# Altium schematic sheet InputCircuits.SchDoc
size A4; SheetNumber: 3; SheetTotal: 6
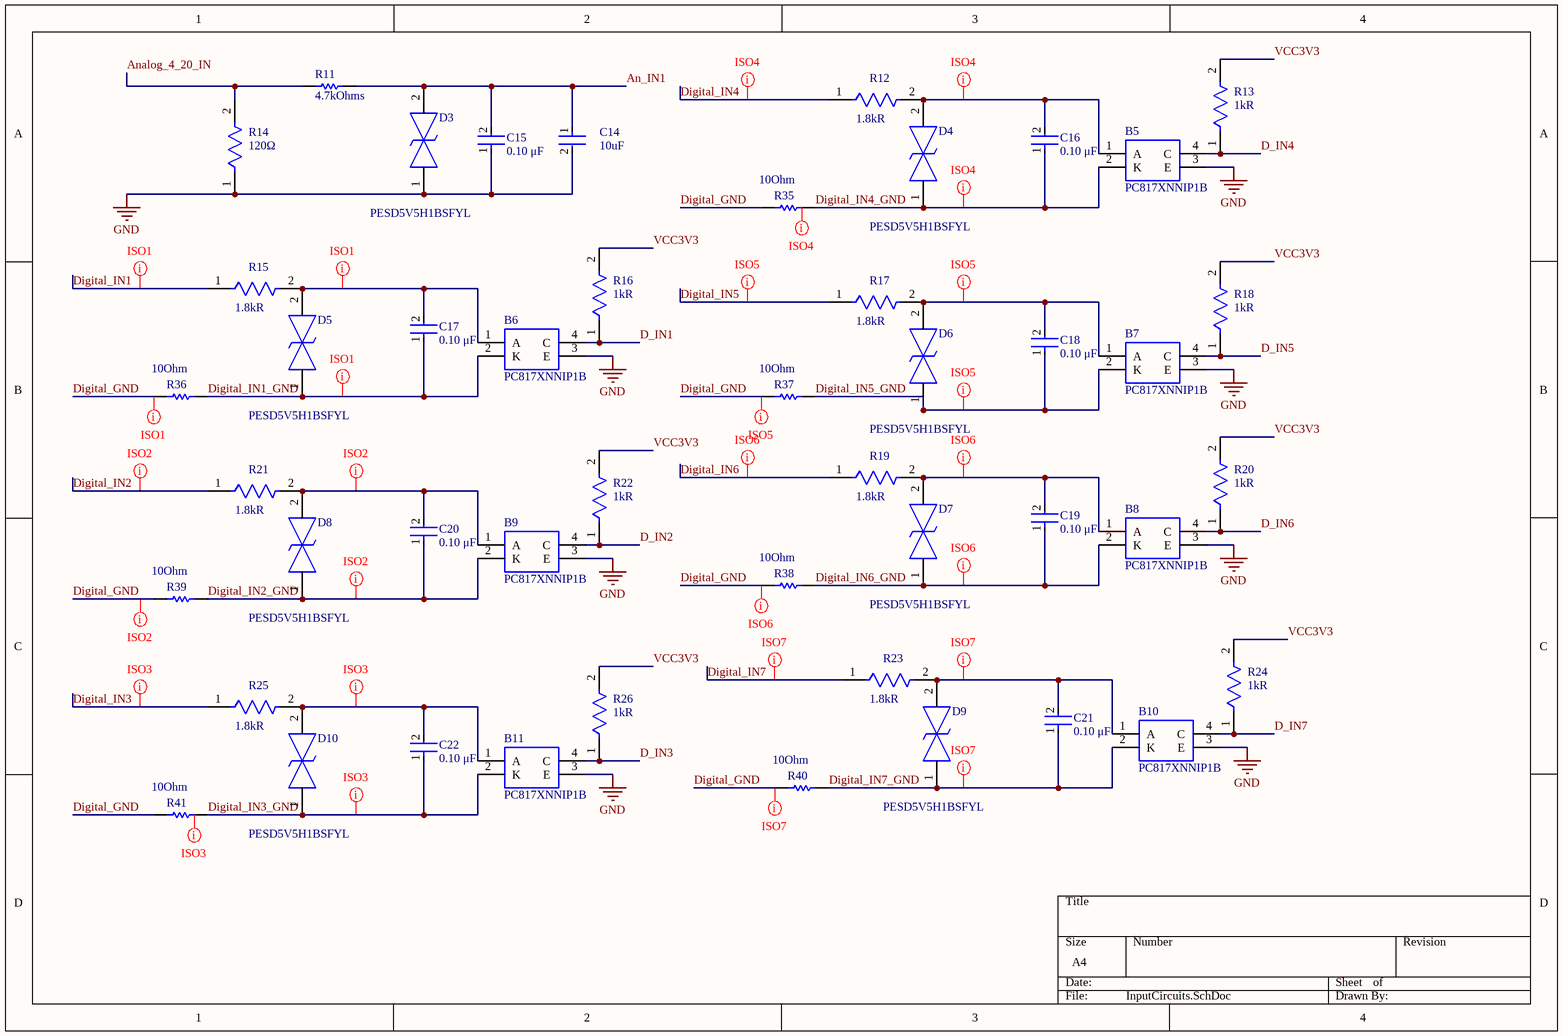
[diagram p0: InputCircuits.SchDoc]

## Parts
B5  PC817XNNIP1B  [SOP254P960X420-4N]
B6  PC817XNNIP1B  [SOP254P960X420-4N]
B7  PC817XNNIP1B  [SOP254P960X420-4N]
B8  PC817XNNIP1B  [SOP254P960X420-4N]
B9  PC817XNNIP1B  [SOP254P960X420-4N]
B10  PC817XNNIP1B  [SOP254P960X420-4N]
B11  PC817XNNIP1B  [SOP254P960X420-4N]
C14  Capacitance: 10uF  [FP-MK212G-MFG]  (hidden comment: LMK212B7106KG-TD)
C15  value 0.10 μF  [FP-C0805C-DN-MFG]  (hidden comment: C0805C104K5RAC7411)
C16  value 0.10 μF  [FP-C0805C-DN-MFG]  (hidden comment: C0805C104K5RAC7411)
C17  value 0.10 μF  [FP-C0805C-DN-MFG]  (hidden comment: C0805C104K5RAC7411)
C18  value 0.10 μF  [FP-C0805C-DN-MFG]  (hidden comment: C0805C104K5RAC7411)
C19  value 0.10 μF  [FP-C0805C-DN-MFG]  (hidden comment: C0805C104K5RAC7411)
C20  value 0.10 μF  [FP-C0805C-DN-MFG]  (hidden comment: C0805C104K5RAC7411)
C21  value 0.10 μF  [FP-C0805C-DN-MFG]  (hidden comment: C0805C104K5RAC7411)
C22  value 0.10 μF  [FP-C0805C-DN-MFG]  (hidden comment: C0805C104K5RAC7411)
D3  PESD5V5H1BSFYL  [PESD5V0H1BSFYL]
D4  PESD5V5H1BSFYL  [PESD5V0H1BSFYL]
D5  PESD5V5H1BSFYL  [PESD5V0H1BSFYL]
D6  PESD5V5H1BSFYL  [PESD5V0H1BSFYL]
D7  PESD5V5H1BSFYL  [PESD5V0H1BSFYL]
D8  PESD5V5H1BSFYL  [PESD5V0H1BSFYL]
D9  PESD5V5H1BSFYL  [PESD5V0H1BSFYL]
D10  PESD5V5H1BSFYL  [PESD5V0H1BSFYL]
R11  Resistance: 4.7kOhms  [RESC1608X55X25LL10T15]  (hidden comment: RC0603FR-074K7L)
R12  Resistance: 1.8kR  [FP-RC0603-0_55-IPC_C]  (hidden comment: RC0603FR-071K8L)
R13  Resistance: 1kR  [FP-RC0603-0_55-IPC_C]  (hidden comment: RC0603FR-071KL)
R14  Resistance: 120Ω  [FP-RT1206-MFG]  (hidden comment: RT1206FRE07120RL)
R15  Resistance: 1.8kR  [FP-RC0603-0_55-IPC_C]  (hidden comment: RC0603FR-071K8L)
R16  Resistance: 1kR  [FP-RC0603-0_55-IPC_C]  (hidden comment: RC0603FR-071KL)
R17  Resistance: 1.8kR  [FP-RC0603-0_55-IPC_C]  (hidden comment: RC0603FR-071K8L)
R18  Resistance: 1kR  [FP-RC0603-0_55-IPC_C]  (hidden comment: RC0603FR-071KL)
R19  Resistance: 1.8kR  [FP-RC0603-0_55-IPC_C]  (hidden comment: RC0603FR-071K8L)
R20  Resistance: 1kR  [FP-RC0603-0_55-IPC_C]  (hidden comment: RC0603FR-071KL)
R21  Resistance: 1.8kR  [FP-RC0603-0_55-IPC_C]  (hidden comment: RC0603FR-071K8L)
R22  Resistance: 1kR  [FP-RC0603-0_55-IPC_C]  (hidden comment: RC0603FR-071KL)
R23  Resistance: 1.8kR  [FP-RC0603-0_55-IPC_C]  (hidden comment: RC0603FR-071K8L)
R24  Resistance: 1kR  [FP-RC0603-0_55-IPC_C]  (hidden comment: RC0603FR-071KL)
R25  Resistance: 1.8kR  [FP-RC0603-0_55-IPC_C]  (hidden comment: RC0603FR-071K8L)
R26  Resistance: 1kR  [FP-RC0603-0_55-IPC_C]  (hidden comment: RC0603FR-071KL)
R35  Resistance: 10Ohm  [RESC2013X60X35ML10T20]  (hidden comment: RC0805FR-0710RL)
R36  Resistance: 10Ohm  [RESC2013X60X35ML10T20]  (hidden comment: RC0805FR-0710RL)
R37  Resistance: 10Ohm  [RESC2013X60X35ML10T20]  (hidden comment: RC0805FR-0710RL)
R38  Resistance: 10Ohm  [RESC2013X60X35ML10T20]  (hidden comment: RC0805FR-0710RL)
R39  Resistance: 10Ohm  [RESC2013X60X35ML10T20]  (hidden comment: RC0805FR-0710RL)
R40  Resistance: 10Ohm  [RESC2013X60X35ML10T20]  (hidden comment: RC0805FR-0710RL)
R41  Resistance: 10Ohm  [RESC2013X60X35ML10T20]  (hidden comment: RC0805FR-0710RL)

## Nets
GND: B5.3(E) B6.3(E) B7.3(E) B8.3(E) B9.3(E) B10.3(E) B11.3(E) C14.2 C15.1 D3.1 R14.1
An_IN1: C14.1 C15.2 D3.2 R11.1
Analog_4_20_IN: R11.2 R14.2
D_IN1: B6.4(C) R16.1
D_IN2: B9.4(C) R22.1
D_IN3: B11.4(C) R26.1
D_IN4: B5.4(C) R13.1
D_IN5: B7.4(C) R18.1
D_IN6: B8.4(C) R20.1
D_IN7: B10.4(C) R24.1
Digital_GND: R35.1 R36.1 R37.1 R38.1 R39.1 R40.1 R41.1
Digital_IN1: R15.1
Digital_IN1_GND: B6.2(K) C17.1 D5.1 R36.2
Digital_IN2: R21.1
Digital_IN2_GND: B9.2(K) C20.1 D8.1 R39.2
Digital_IN3: R25.1
Digital_IN3_GND: B11.2(K) C22.1 D10.1 R41.2
Digital_IN4: R12.1
Digital_IN4_GND: B5.2(K) C16.1 D4.1 R35.2
Digital_IN5: R17.1
Digital_IN5_GND: B7.2(K) C18.1 D6.1 R37.2
Digital_IN6: R19.1
Digital_IN6_GND: B8.2(K) C19.1 D7.1 R38.2
Digital_IN7: R23.1
Digital_IN7_GND: B10.2(K) C21.1 D9.1 R40.2
VCC3V3: R13.2 R16.2 R18.2 R20.2 R22.2 R24.2 R26.2
NetB5_1: B5.1(A) C16.2 D4.2 R12.2
NetB6_1: B6.1(A) C17.2 D5.2 R15.2
NetB7_1: B7.1(A) C18.2 D6.2 R17.2
NetB8_1: B8.1(A) C19.2 D7.2 R19.2
NetB9_1: B9.1(A) C20.2 D8.2 R21.2
NetB10_1: B10.1(A) C21.2 D9.2 R23.2
NetB11_1: B11.1(A) C22.2 D10.2 R25.2

## Layout directives
net class ISO1: Digital_GND, Digital_IN1, Digital_IN1_GND, NetB6_1
net class ISO2: Digital_GND, Digital_IN2, Digital_IN2_GND, NetB9_1
net class ISO3: (no net found under the mark), Digital_IN3, Digital_IN3_GND, NetB11_1
net class ISO4: (no net found under the mark), Digital_IN4, Digital_IN4_GND, NetB5_1
net class ISO5: Digital_GND, Digital_IN5, Digital_IN5_GND, NetB7_1
net class ISO6: Digital_GND, Digital_IN6, Digital_IN6_GND, NetB8_1
net class ISO7: Digital_GND, Digital_IN7, Digital_IN7_GND, NetB10_1

## Library data of the parts
B5-B11 = PC817XNNIP1B: Transistor Output Optocouplers Photocoupler; Manufacturer_Name: Sharp Microelectronics; Geometry.Height: 4.2mm; Mouser Part Number: 852-PC817XNNIP1B; Mouser Price/Stock: https://www.mouser.co.uk/ProductDetail/Sharp-Microelectronics/PC817XNNIP1B?qs=rrS6PyfT74dJvnx7366b6Q%3D%3D; Manufacturer_Part_Number: PC817XNNIP1B; Datasheet Link: *
C14 = CMP-2000-06556-2: CAP CER 10UF 10V X7R 0805; Tolerance: 10%; Number of Pins: 2; Height: 1.25mm; Length: 0.079inch; Case Code (Metric): 2012; Thickness: 0.053inch; Width: 0.049inch; Dielectric: X7R; Case Code (Imperial): 0805; Case/Package: 0805; Termination: SMD/SMT; Resistor Type: Ceramic; Lead Free: Lead Free; Voltage Rating: 10V; Package Quantity: 1; Max Operating Temperature: 125°C; RoHS Compliant: Yes; Series: M; Packaging: Tape and Reel; Mount: Surface Mount; Min Operating Temperature: -55°C; Voltage Rating (DC): 10V
C15-C22 = CMP-2007-00277-3: C0805 0.10 μF X7R 30ppm/°C 10.00% 50 V; Manufacturer: KEMET; Material: Ceramic; Tolerance: 0.1; Voltage Rating: 50 V; Temperature: -55°C to +125°C; Device Class L3: Ceramic Capacitors; Temperature Characteristic: X7R; Device Class L1: Passive Components; Category: Cap; Temperature Coefficient: 30ppm/°C; Manufacturer Part Number: C0805C104K5RAC7411; Temperature Range High: +125°C; Height: 0.88mm; RoHS: TRUE; ComponentLink2Description: Datasheet; Lead Free: Yes; Capacitance: 0.10 μF; Package: C0805C-DN; Temperature Range Low: -55°C; ComponentLink2URL: https://content.kemet.com/datasheets/KEM_C1003_C0G_SMD.pdf; Automotive: No; Ipc Land Pattern Name: CAPC200125X78; Octopart: https://octopart.com/c0805c104k5rac7411-kemet-18508045; Device Class L2: Capacitors
D3-D10 = PESD5V5H1BSFYL: ESD Suppressors / TVS Diodes; Manufacturer_Name: Nexperia; Geometry.Height: 0.325mm; Mouser Part Number: 771-PESD5V5H1BSFYL; Mouser Price/Stock: https://www.mouser.co.uk/ProductDetail/Nexperia/PESD5V5H1BSFYL?qs=T3oQrply3y9CfA%2FMHqAcog%3D%3D; Manufacturer_Part_Number: PESD5V5H1BSFYL; Datasheet Link: https://assets.nexperia.com/documents/data-sheet/PESD5V0H1BSF.pdf
R11 = CMP-2000-06942-1: Chip Resistor, 4.7 KOhm, +/- 1%, 0.1 W, -55 to 155 degC, 0603 (1608 Metric), RoHS, Tape and Reel; Manufacturer: Yageo; Power Rating: 100mW; Temperature Coefficient: 100PPM/C; Voltage Rating: 50V; Package Reference: 0603; Series: RC; Datasheet Version: Rev. 7, 05/2017; Packaging: Reel; Termination Style: SMD/SMT; Datasheet URL: http://www.yageo.com/documents/recent/PYu-RC_Group_51_RoHS_L_7.pdf; Manufacturer URL: http://www.yageo.com/; Package Description: 2-Pin Surface Mount Device, Body 1.6 x 0.8 mm; Case Code - mm: 1608; Case Code - in: 0603; Mounting Technology: SurfaceMount; Operating Temperature Range: -55Cto+155C; Tolerance: 1%; Product: ThickFilmResistorsGeneralPurpose
R12 R15 R17 R19 R21 R23 R25 = CMP-2000-06931-2: RES SMD 1.8K OHM 1% 1/10W 0603; Power Rating: 100mW; Voltage Rating (DC): 50V; Temperature Coefficient: 100ppm/°C; REACH SVHC: No SVHC; Construction: Rectangular; Resistance Tolerance: 1%; Package Quantity: 5000; Tolerance: 1%; Min Operating Temperature: -55°C; Case Code (Metric): 1608; Number of Terminations: 2; Case/Package: 0603; Number of Pins: 2; Max Power Dissipation: 100mW; Max Operating Temperature: 155°C; Technology: THICK FILM; Resistor Type: Thick Film; Voltage Rating: 50V; Depth: 0.8mm; Size Code: 0603; Width: 0.8mm; Features: Moisture Resistant; Lead Free: Lead Free; Height: 0.45mm; RoHS Compliant: Yes; Termination: SMD/SMT; Military Standard: Not; Case Code (Imperial): 0603; Packaging: Tape and Reel; Series: RC; Length: 1.6mm
R13 R16 R18 R20 R22 R24 R26 = CMP-1659-00009-5: RES 1K OHM 1% 1/10W 0603; Voltage Rating: 50V; Power Rating: 100mW; Temperature Coefficient: 100ppm/°C; Military Standard: Not; REACH SVHC: No SVHC; Size Code: 0603; Features: Moisture Resistant; Number of Terminations: 2; Technology: THICK FILM; Series: RC; Case Code (Metric): 1608; Resistance Tolerance: 1%; Resistor Type: Thick Film; Termination: SMD/SMT; Contact Plating: Tin; Radiation Hardening: No; Min Operating Temperature: -55°C; Max Operating Temperature: 155°C; Packaging: Tape and Reel; Max Power Dissipation: 100mW; RoHS Compliant: Yes; Height: 0.45mm; Lead Free: Lead Free; Case/Package: 0603; Length: 1.6mm; Tolerance: 1%; Case Code (Imperial): 0603; Construction: Rectangular; Depth: 0.8mm
R14 = CMP-2003-04301-2: RES SMD 120 OHM 1% 1/4W 1206; Manufacturer: Yageo; Value: 120Ω; Temperature Coefficient: 50 ppm/°C; Voltage Rating: 200V; Power Rating: 0.25W; Tolerance: 0.0002; Package: RT1206; Mouser Description: Thin Film Resistors - SMD 1/4W 120 ohm 1% 50ppm; Digikey Description: RES SMD 120 OHM 1% 1/4W 1206; Manufacturer Part Number: RT1206FRE07120RL; Temperature Range Low: -55°C; Height: 0.65mm; Footprint Url: http://www.yageo.com/exep/pages/download/literatures/PYu-R_Mount_10.pdf; Octopart: https://octopart.com/rt1206fre07120rl-yageo-1433320; Device Class L3: Chip SMD Resistors; Automotive: No; Temperature: -55°C to +155°C; Series: RT; Category: Res; ComponentLink2URL: http://www.yageo.com/documents/recent/PYu-RT_1-to-0.01_RoHS_L_9.pdf; Temperature Range High: +155°C; Ipc Land Pattern Name: RESC310160X55; Device Class L1: Passive Components; Device Class L2: Resistors; ComponentLink2Description: Datasheet; RoHS: TRUE; Lead Free: Yes; Composition: Thin Film
R35-R41 = CMP-2100-03670-1: Chip Resistor, 10 Ohm, +/- 1%, 0.125 W, -55 to 155 degC, 0805 (2012 Metric), RoHS, Tape and Reel; Manufacturer: Yageo; Power Rating: 125mW; Voltage Rating: 150V; Temperature Coefficient: 200ppm/degreesC; Number of Pins: 2; REACH SVHC: NoSVHC; Datasheet Version: Rev. 5, 10/2016; Max Operating Temperature: 155degC; Manufacturer URL: http://www.yageo.com/; Case Code (Imperial): 0805; Package Description: 2-Pin Surface Mounted Device, Body 2 x 1.25 mm; Case Code (Metric): 2012; Length: 2mm; RoHSCompliant: true; Max Power Dissipation: 125mW; Depth: 1.25mm; Packaging: TapeandReel; Height: 0.5mm; Package Reference: 0805; Package Quantity: 1; Tolerance: 1%; Termination: SMD/SMT; Min Operating Temperature: -55degC; Lead Free: LeadFree; Width: 1.25mm; Voltage Rating (DC): 150V; Datasheet URL: http://www.yageo.com/NewPortal/yageodocoutput?fileName=/pdf/R-Chip/PYu-RC_Group_51_RoHS_L_5.pdf; Composition: ThickFilm; Number of Terminations: 2; Case/Package: 0805